# Altium schematic sheet MDL_RECEPTOR_IRF_1.SchDoc
size A4
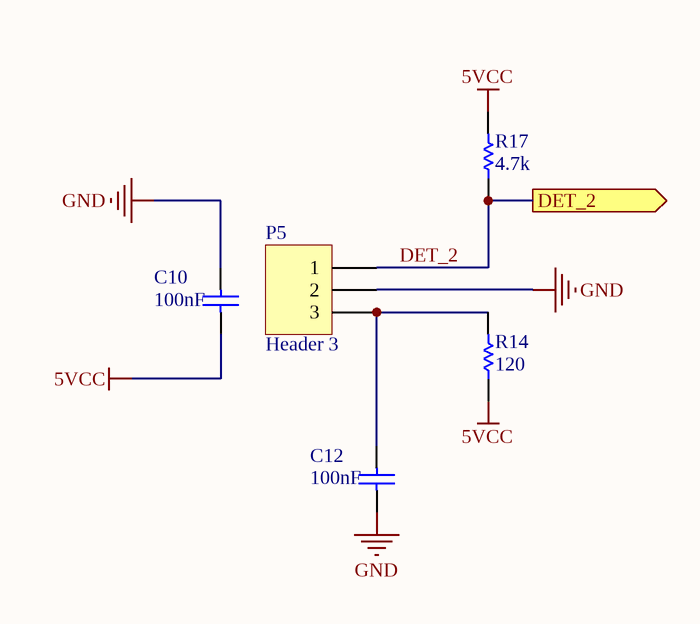
[diagram p0: MDL_RECEPTOR_IRF_1.SchDoc]

## Parts
C10  value 100nF  [VP44-2.5]  (hidden comment: VP44BY224JB)
C12  value 100nF  [VP44-2.5]  (hidden comment: VP44BY224JB)
P5  Header 3  [HDR1X3]
R14  value 120  [AXIAL-0.3]  (hidden comment: Res)
R17  value 4.7k  [AXIAL-0.3]  (hidden comment: Res)

## Ports
DET_2 (out)

## Nets
5VCC: C10.2 R14.1 R17.2
GND: C10.1 C12.2 P5.2
DET_2: P5.1 R17.1 ; port DET_2
NetC12_1: C12.1 P5.3 R14.2

## Library data of the parts
C10 C12 = VP44BY224JB: Dipped Radial Multilayer Ceramic Capacitor X7R: 220nF, 100V; Published: 17-Dec-2003; DatasheetDocument: 4-Feb-2002; PackageDocument: 4-Feb-2002; PackageReference: VP44-2.5; Publisher: Altium Limited; ComponentLink1Description: Manufacturer Link; ComponentLink1URL: http://www.vishay.com/
P5 = Header 3: Header, 3-Pin; LatestRevisionDate: 17-Jul-2002; LatestRevisionNote: Re-released for DXP Platform.; Publisher: Altium Limited
R14 R17 = Res1: Resistor; Published: 8-Jun-2000; LatestRevisionDate: 17-Jul-2002; LatestRevisionNote: Re-released for DXP Platform.; PackageReference: AXIAL-0.3; Publisher: Altium Limited